# Altium project Power_24Vto160V.PrjPcb
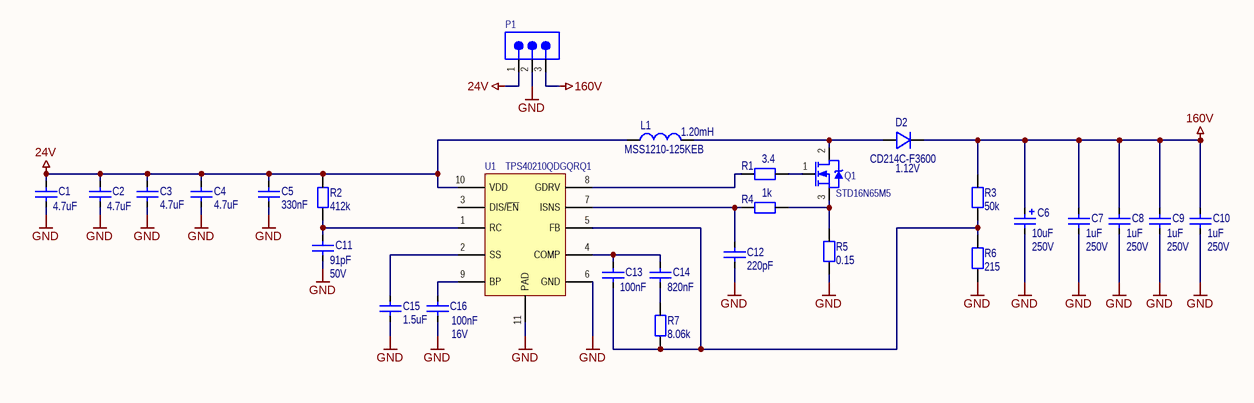
[diagram p0: Power_24Vto160V.SchDoc]
1 sheet, 28 parts. Net scope: global (net labels, ports and power ports of the same name join across sheets).
Board file: Power_24Vto160V.PcbDoc

## Sheet Power_24Vto160V.SchDoc
size A3

### Parts
C1  4.7uF  [1210_C]
C2  4.7uF  [1210_C]
C3  4.7uF  [1210_C]
C4  4.7uF  [1210_C]
C5  330nF  [0603_C]
C6  10uF  voltage_rating: 250V  [CAPAE109103X100M]
C7  1uF  voltage_rating: 250V  [CAPC5750X27_EIA-2220]
C8  1uF  voltage_rating: 250V  [CAPC5750X27_EIA-2220]
C9  1uF  voltage_rating: 250V  [CAPC5750X27_EIA-2220]
C10  1uF  voltage_rating: 250V  [CAPC5750X27_EIA-2220]
C11  91pF  voltage_rating: 50V  [0603_C]
C12  220pF  [CAPC2012X12_EIA-0805]
C13  100nF  [CAPC2012X12_EIA-0805]
C14  820nF  [CAPC1005X05_EIA-0402]
C15  1.5uF  [0603_C]
C16  100nF  voltage_rating: 16V  [0603_C]
D2  CD214C-F3600  voltage: 1.12V  [DIOM6959X26N]
L1  1.20mH  [IND_COILCRAFT_MSS1260]
P1  power  [MOLEX_22-28-4030]  (value not drawn)
Q1  STD16N65M5  [DPAK228P972X240-3N]
R1  3.4  [0603_R]
R2  412k  [0603_R]
R3  50k  [RESC3216X06_EIA-1206]
R4  1k  [0603_R]
R5  0.15  [0603_R]
R6  215  [0603_R]
R7  8.06k  [0603_R]
U1  TPS40210QDGQRQ1  [TSSOP50P490X110_HS-11N]

### Nets
24V: C1.2 C2.2 C3.2 C4.2 C5.2 L1.1 P1.1 R2.2 U1.10(VDD)
160V: C6.1 C7.2 C8.2 C9.2 C10.2 D2.1(K) P1.3 R3.2
GND: C1.1 C2.1 C3.1 C4.1 C5.1 C6.2 C7.1 C8.1 C9.1 C10.1 C11.1 C12.1 C15.1 C16.1 P1.2 R5.1 R6.1 U1.6(GND) U1.11(PAD)
NetC11_2: C11.2 R2.1 U1.1(RC)
NetC12_2: C12.2 R4.1 U1.7(ISNS)
NetC13_1: C13.1 R3.1 R6.2 R7.1 U1.5(FB)
NetC13_2: C13.2 C14.2 U1.4(COMP)
NetC14_1: C14.1 R7.2
NetC15_2: C15.2 U1.2(SS)
NetC16_2: C16.2 U1.9(BP)
NetD2_2: D2.2(A) L1.2 Q1.2(D)
NetQ1_1: Q1.1(G) R1.2
NetQ1_3: Q1.3(S) R4.2 R5.2
NetR1_1: R1.1 U1.8(GDRV)

Not connected (* = marked no-connect by the designer): U1 3(DIS/~{EN})

### Library data of the parts
C1-C4 = GRM32ER71H475KA88L: manufacturer: muRata; mounting_connection: SMT; technology_material: CERAMIC(X7R); tolerance: ±10%; voltage_rating: 50V; casing: SMD chip 1210; capacitance_value: 4.7uF; order_number: GRM32ER71H475KA88L; series: Standard
C5 = C1608X5R1H334K080AB: manufacturer: TDK; mounting_connection: SMT; technology_material: CERAMIC(X7R); tolerance: ±10%; voltage_rating: 50V; casing: SMD chip 0603; capacitance_value: 330nF; order_number: C1608X5R1H334K080AB; series: Standard
C6 = UUX2E100MNL1GS: manufacturer: Nichicon; mounting_connection: SMT; technology_material: ELEKTROLYT; tolerance: ±20%; casing: SMD case , Ø=10,Hight=10; temperature_range: -55°C to +105°C; capacitance_value: 10uF; order_number: UUX2E100MNL1GS; series: FK
C7-C10 = GRM55DR72E105KW01L: manufacturer: muRata; ALTERNATIVE_PART: allowed; mounting_connection: SMT; technology_material: CERAMIC(X7R); tolerance: ±10%; casing: SMD chip 2220; temperature_range: -55°C to +125°C; capacitance_value: 1uF; order_number: GRM55DR72E105KW01L; series: Standard
C11 = GRM1885C1H910JA01D: manufacturer: muRata; ALTERNATIVE_PART: allowed; mounting_connection: SMT; technology_material: CERAMIC(X7R); tolerance: ±10%; casing: SMD chip 0603; temperature_range: -55°C to +125°C; capacitance_value: 91pF; order_number: GRM1885C1H910JA01D; series: Standard
C12 = CC0805JRNPO9BN221: manufacturer: Yageo; mounting_connection: SMT; technology_material: CERAMIC(X7R); tolerance: ±10%; voltage_rating: 50V; casing: SMD chip 0805; capacitance_value: 220pF; order_number: CC0805JRNPO9BN221; series: Standard
C13 = CC0805KRX7R8BB104: manufacturer: Yageo; mounting_connection: SMT; technology_material: CERAMIC(X7R); tolerance: ±10%; voltage_rating: 25V; casing: SMD chip 0805; capacitance_value: 100nF; order_number: CC0805KRX7R8BB104; series: Standard
C14 = GRM155R61A824KE15D: manufacturer: muRata; mounting_connection: SMT; technology_material: CERAMIC(X5R); tolerance: ±10%; voltage_rating: 10V; casing: SMD chip 0402; capacitance_value: 820nF; order_number: GRM155R61A824KE15D; series: Standard
C15 = C1608X7R1A155K080AC: manufacturer: TDK; mounting_connection: SMT; technology_material: CERAMIC(X7R); tolerance: ±10%; voltage_rating: 10V; casing: SMD chip 0603; capacitance_value: 1.5uF; order_number: C1608X7R1A155K080AC; series: Standard
C16 = EMK107B7105KA-T: manufacturer: Taiyo Yuden; mounting_connection: SMT; technology_material: CERAMIC(X7R); tolerance: ±10%; casing: SMD chip 0603; capacitance_value: 100nF; order_number: EMK107B7105KA-T; series: Standard
D2 = CD214C-F3600: 600V, 3amp; amp: 3A; order: CD214C-F3600; package: DO-214AB
L1 = MSS1210-125KEB: Inductor; res: 1.07Ohm; ordernumber: MSS1210-125KEB
P1 = 1007795: Header single row 1x3pin; PART_Description: CON-M/THT/42375/1x3P/2.54mm/S; manufacturer: molex; #2_custom_layout_instruction: IDF entry design specific layout instruction (if needed); #1_general_layout_instruction: link to datasheet based layout instruction (entry from Excel macro); mounting_connection: THT; casing: Breakaway Header KK 2.54mm; pin_configuration: 1x3P; grid_pitch: 2.54mm; contact_material: TIN; pluggable_pin_length: 6.09mm; voltage_rating: 250V; current_rating: 4A; safety_standard: UL1977,UL94-0; UL_file: ECBT2.E29179,ECBT8.E29179; CHECK_STATE: 2014-07-24_DW_MJ; Published: 2014-07-24_MJ; custom_silkscreen_description: power; PART_NUMBER: 1007795; orientation: STRAIGHT/GERADE; order_number: 22-28-4030; series: 42375 KK; US_MATERIALNUMBER: 1007795
Q1 = STD16N65M5: N-channel MOSFET 650V; #1_general_layout_instruction: link to datasheet based layout instruction (entry from Excel macro); #2_custom_layout_instruction: entry design specific layout instruction (if needed); availability_state: DPAK; order_number: STD16N65M5; PART_NUMBER: STD16N65M5
R1 = CRCW06033R40FKEA: PART_NUMBER: 1347890; manufacturer: Vishay; mounting_connection: SMT; tolerance: 1%; power_rating: 0.1W; casing: SMD chip 0603; technology_material: METALFILM; temperature_range: -55°C to +155°C; TCR: 100ppm; resistor_value: 3.4; order_number: CRCW06033R40FKEA
R2 = R_ERJ-3EKF4123V: ERJ-3EKF4123V; PART_NUMBER: 1347890; manufacturer: YAGEO (Phycomp); mounting_connection: SMT; tolerance: 1%; power_rating: 0.1W; casing: SMD chip 0603; technology_material: METALFILM; temperature_range: -55°C to +155°C; TCR: 100ppm; resistor_value: 412k; order_number: ERJ-3EKF4123V
R3 = PNM1206E5002BST1: PART_NUMBER: 1347890; manufacturer: Vishay; mounting_connection: SMT; tolerance: 0.1%; power_rating: 400mW; casing: SMD chip 0603; technology_material: METALFILM; temperature_range: -55°C to +155°C; TCR: 100ppm; resistor_value: 50k; order_number: PNM1206E5002BST1
R4 = CRCW02011K00FKED: PART_NUMBER: 1347890; manufacturer: Vishay; mounting_connection: SMT; tolerance: 1%; power_rating: 50mW; casing: SMD chip 0603; technology_material: METALFILM; temperature_range: -55°C to +155°C; TCR: 100ppm; resistor_value: 1k; order_number: CRCW02011K00FKED
R5 = ERJ-3RSFR15V: manufacturer: Panasonic; mounting_connection: SMT; tolerance: 1%; power_rating: 50mW; casing: SMD chip 0603; technology_material: METALFILM; temperature_range: -55°C to +155°C; TCR: 100ppm; resistor_value: 0.15; order_number: ERJ-3RSFR15V
R6 = ERJ-3EKF2150V: manufacturer: Panasonic; mounting_connection: SMT; tolerance: 1%; power_rating: 100mW; casing: SMD chip 0603; technology_material: METALFILM; temperature_range: -55°C to +155°C; TCR: 100ppm; resistor_value: 215; order_number: ERJ-3EKF2150V
R7 = R_CRCW06038K06FKEA: CRCW06038K06FKEA; PART_NUMBER: 1347890; manufacturer: Vishay; mounting_connection: SMT; tolerance: 1%; power_rating: 0.1W; casing: SMD chip 0603; technology_material: METALFILM; temperature_range: -55°C to +155°C; TCR: 100ppm; resistor_value: 8.06k; order_number: CRCW06038K06FKEA
U1 = TPS40210-Q1: manufacturer: TI; #1_general_layout_instruction: link to datasheet based layout instruction (entry from Excel macro); #2_custom_layout_instruction: entry design specific layout instruction (if needed); custom_silkscreen_description: entry silkscreen text (if needed); mounting_connection: SMT; Published: 2014-07-15_MLa_xx; order_number: TPS40210QDGQRQ1